# EAGLE design I2CPANEL (EAGLE 9.6.0)
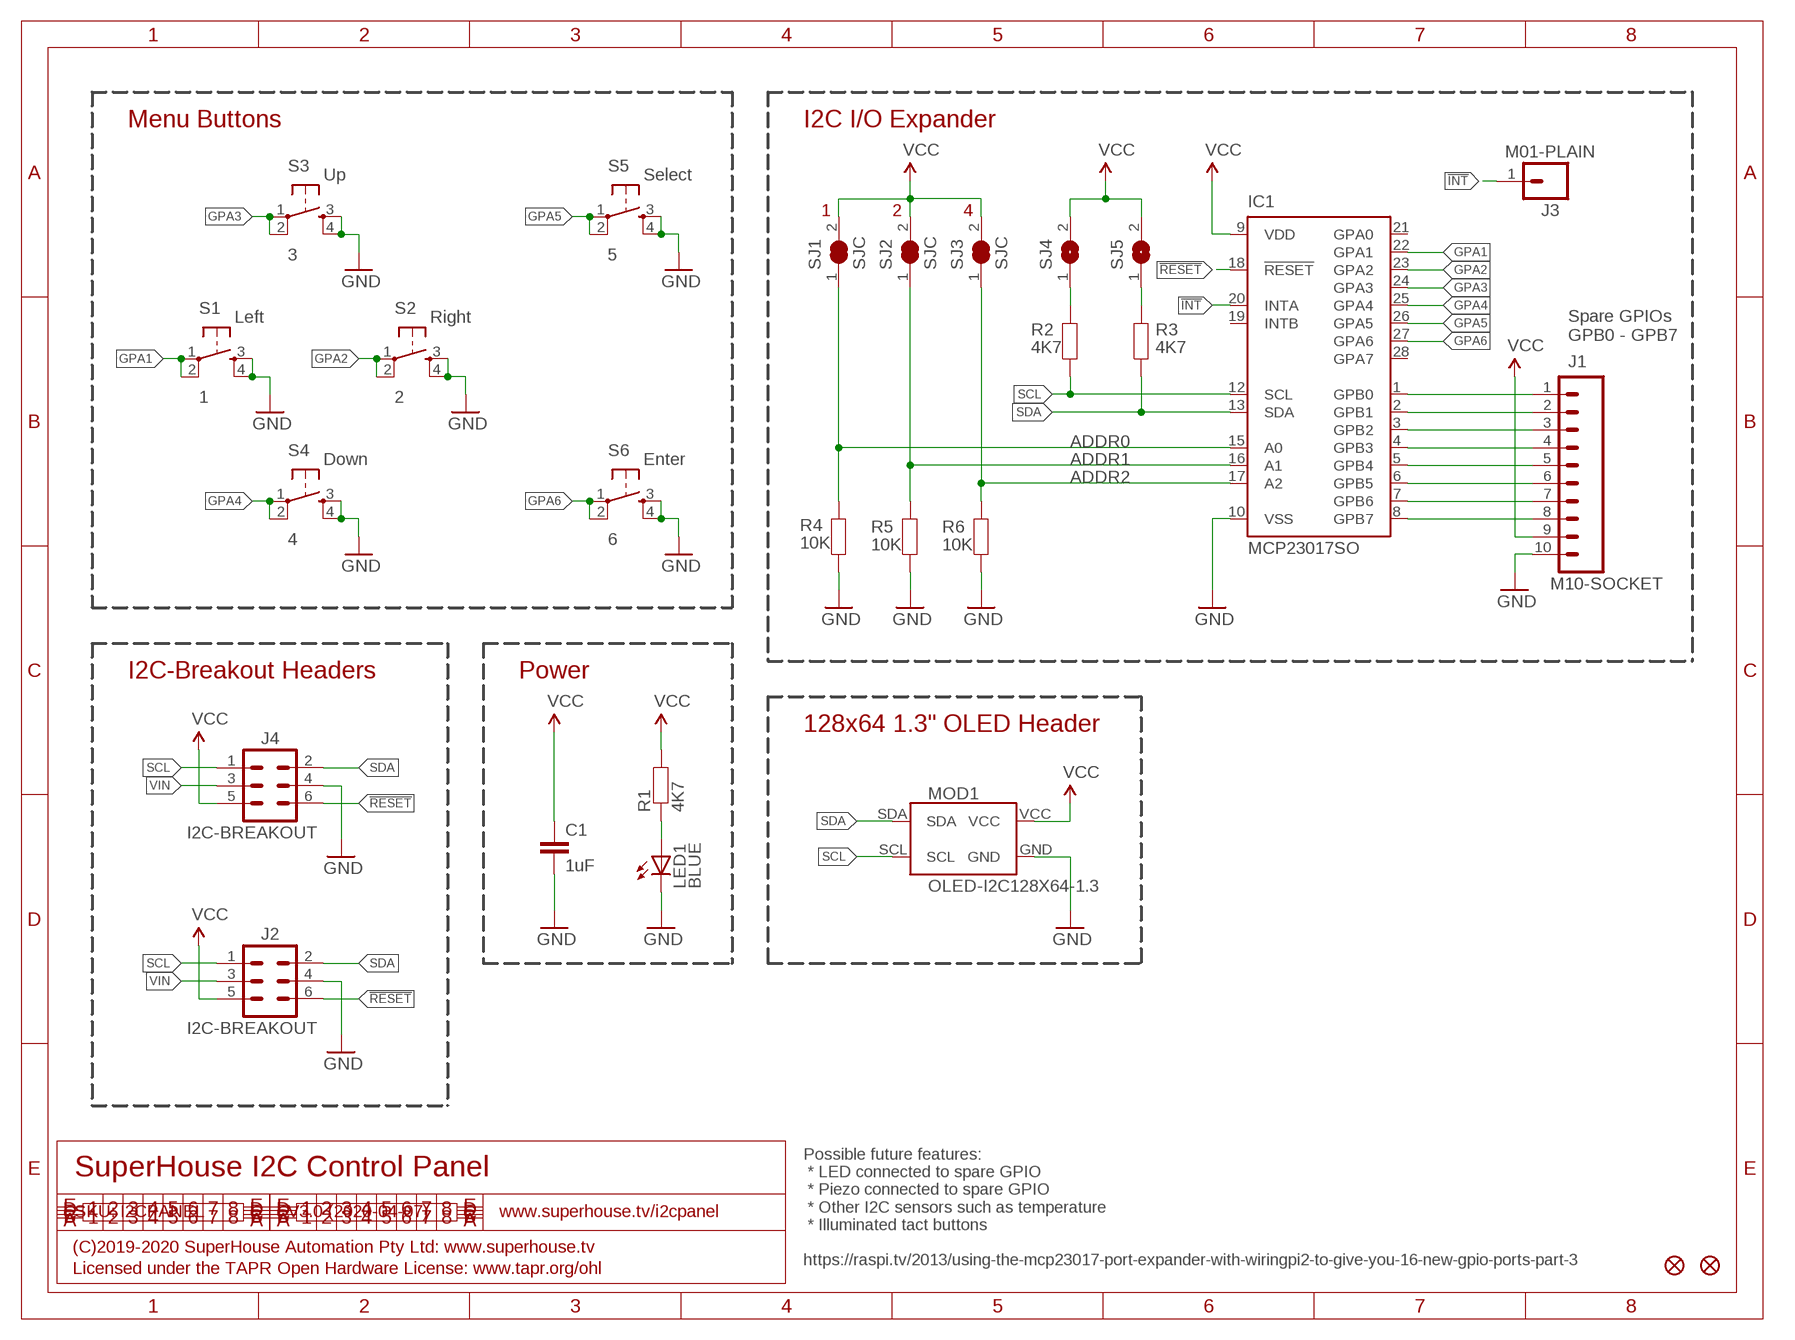
[diagram p0: schematic, sheet 1]

## Parts
C1  1uF  CAP0603  [C0603]
FID1  FIDUCIAL1X2.5  [FIDUCIAL-1X2.5]
FID2  FIDUCIAL1X2.5  [FIDUCIAL-1X2.5]
IC1  MCP23017SO  [SO28W]
J1  M10-SOCKET  [1X10-S]
J2  I2C-BREAKOUT  M02X3-SHROUDED  [2X03-SHROUDED]
J3  M01-PLAIN  [1X01]
J4  I2C-BREAKOUT  M02X3-SHROUDED  [2X03-SHROUDED]
LED1  BLUE  LED0603  [LED-0603]
MOD1  OLED-I2C128X64-1.3  [OLED-128X64-1.3]
R1  4K7  RESISTOR0603  [R0603]
R2  4K7  RESISTOR0603  [R0603]
R3  4K7  RESISTOR0603  [R0603]
R4  10K  RESISTOR0603  [R0603]
R5  10K  RESISTOR0603  [R0603]
R6  10K  RESISTOR0603  [R0603]
S1  1  TAC_SWITCH-PTH-6  [TACTILE-PTH-6MM]
S2  2  TAC_SWITCH-PTH-6  [TACTILE-PTH-6MM]
S3  3  TAC_SWITCH-PTH-6  [TACTILE-PTH-6MM]
S4  4  TAC_SWITCH-PTH-6  [TACTILE-PTH-6MM]
S5  5  TAC_SWITCH-PTH-6  [TACTILE-PTH-6MM]
S6  6  TAC_SWITCH-PTH-6  [TACTILE-PTH-6MM]
SJ1  SJC  SJC-NORMAL  [SJC]
SJ2  SJC  SJC-NORMAL  [SJC]
SJ3  SJC  SJC-NORMAL  [SJC]
SJ4  SJN  [SJ]
SJ5  SJN  [SJ]

## Nets
!INT: IC1.20(INTA) J3.1
!RESET: IC1.18(!RESET) J2.6 J4.6
ADDR0: IC1.15(A0) R4.2 SJ1.1
ADDR1: IC1.16(A1) R5.2 SJ2.1
ADDR2: IC1.17(A2) R6.2 SJ3.1
GND: C1.2 IC1.10(VSS) J1.10 J2.4 J4.4 LED1.C MOD1.GND R4.1 R5.1 R6.1 S1.3 S1.4 S2.3 S2.4 S3.3 S3.4 S4.3 S4.4 S5.3 S5.4 S6.3 S6.4
GPA1: IC1.22(GPA1) S1.1 S1.2
GPA2: IC1.23(GPA2) S2.1 S2.2
GPA3: IC1.24(GPA3) S3.1 S3.2
GPA4: IC1.25(GPA4) S4.1 S4.2
GPA5: IC1.26(GPA5) S5.1 S5.2
GPA6: IC1.27(GPA6) S6.1 S6.2
N$1: IC1.1(GPB0) J1.1
N$2: IC1.2(GPB1) J1.2
N$3: IC1.3(GPB2) J1.3
N$4: IC1.4(GPB3) J1.4
N$5: IC1.5(GPB4) J1.5
N$6: LED1.A R1.1
N$7: IC1.6(GPB5) J1.6
N$8: IC1.7(GPB6) J1.7
N$9: IC1.8(GPB7) J1.8
N$42: R2.2 SJ4.1
N$43: R3.2 SJ5.1
SCL: IC1.12(SCL) J2.1 J4.1 MOD1.SCL R2.1
SDA: IC1.13(SDA) J2.2 J4.2 MOD1.SDA R3.1
VCC: C1.1 IC1.9(VDD) J1.9 J2.5 J4.5 MOD1.VCC R1.2 SJ1.2 SJ2.2 SJ3.2 SJ4.2 SJ5.2
VIN: J2.3 J4.3
Unconnected: IC1.19(INTB) IC1.21(GPA0) IC1.28(GPA7)

## Notes on the sheet
- Menu Buttons | I2C I/O Expander
- Up | Select
- 1 | 2 | 4
- Left | Right
- Spare GPIOs
  GPB0 - GPB7
- Down | Enter
- I2C-Breakout Headers | Power
- 128x64 1.3" OLED Header
- SuperHouse I2C Control Panel
- SKU: I2CPANEL | V3.0 (2020-04-07) | www.superhouse.tv/i2cpanel
- (C)2019-2020 SuperHouse Automation Pty Ltd: www.superhouse.tv
- Possible future features:
   * LED connected to spare GPIO
   * Piezo connected to spare GPIO
   * Other I2C sensors such as temperature
   * Illuminated tact buttons
  
  https://raspi.tv/2013/using-the-mcp23017-port-expander-with-wiringpi2-to-give-you-16-new-gpio-ports-part-3
- Licensed under the TAPR Open Hardware License: www.tapr.org/ohl

## Library data of the parts
C1 = SuperHouse-DiscreteSemi:CAP: Capacitor Standard ceramic capacitor
FID1 FID2 = freetronics:FIDUCIAL: Fiducial Alignment Points Various fiducial points for machine vision alignment.
IC1 = SuperHouse-ICs:MCP23017: http://ww1.microchip.com/downloads/en/DeviceDoc/21952a.pdf Source: http://ww1.microchip.com/downloads/en/DeviceDoc/21952a.pdf
J1 = SuperHouse-Connectors:M10: 1x10 header
J2 J4 = SuperHouse-Connectors:M02X3: 0.1" header, 2x3 (6-way)
J3 = SuperHouse-Connectors:M01: 1-way header Standard 1x1 header
LED1 = SuperHouse-LEDs:LED: LEDs Standard schematic elements and footprints for 5mm, 3mm, 1206, and 0603 sized LEDs. 5mm - Spark Fun Electronics SKU : COM-00529 (and others)
MOD1 = SuperHouse-Displays:OLED-I2C: OLED module with SSD1306 I2C driver
R1-R6 = SuperHouse-DiscreteSemi:RESISTOR: Resistor Standard resistors.
S1-S6 = SuperHouse-Switches:TAC_SWITCH: Momentary Switch Tactile switch, normally-open.
SJ1-SJ3 = SuperHouse-Jumpers:SJC: Solder jumper. Normally closed: does not need solder to close. Can be opened by cutting the track.
SJ4 SJ5 = freetronics-jon:SJ: SMD solder JUMPER

## Net classes
0 default: width 0.152 mm, drill 0.241 mm, clearance 0.152 mm

## Board
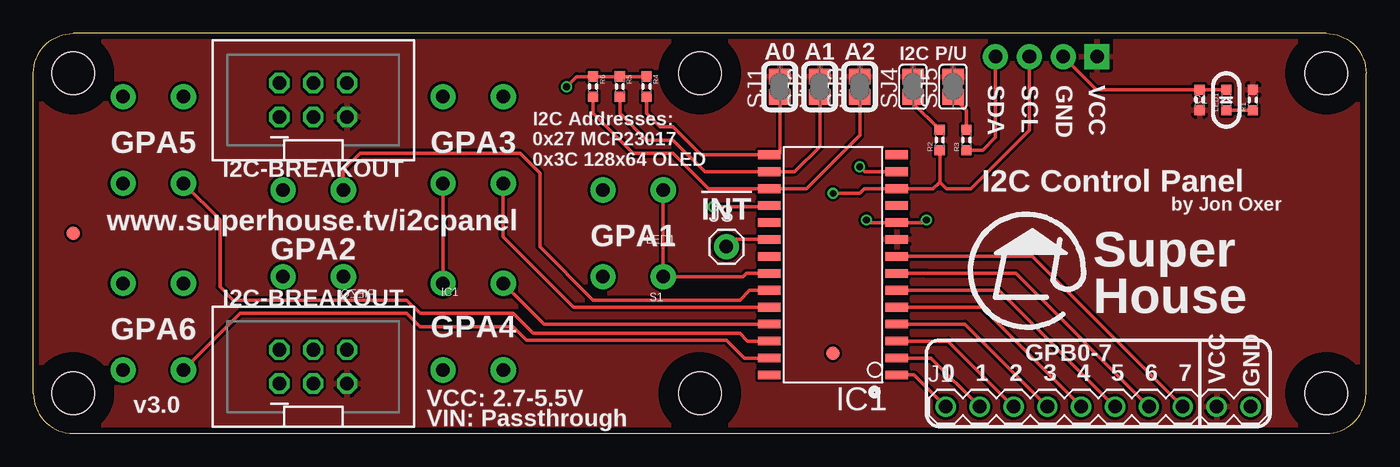
[diagram p1: board, top side]
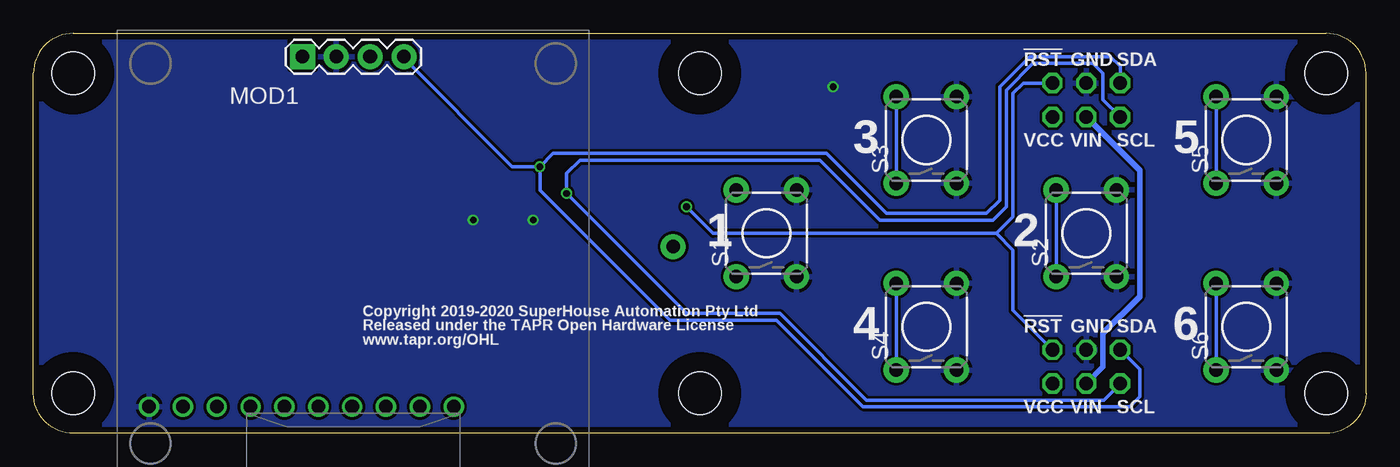
[diagram p2: board, bottom side, seen from below]

Size 100 x 30 mm. Coordinates in mm from the lower left corner, seen from the top.
Outline: 3,0 97,0 arc90 100,3 100,27 arc90 97,30 3,30 arc90 0,27 0,3 arc90 3,0
Copper layers (1*16): Top 0.035mm / dielectric 1.5mm / Bottom 0.035mm
Design rules "freetronics-design-rules": minimum track width 8mil, minimum drill 15mil, track to track 8mil, track to pad 8mil, pad to pad 8mil, via to via 8mil, smd to smd 6mil, copper to edge 18mil, drill to drill 8mil, minimum pad ring 4mil, minimum via ring 6mil, stop-mask expansion 4mil, vias tented up to drill 25mil, thermal gap 10mil
Holes 3.2 mm at 3,27 97,27 3,3 97,3 50,27 50,3
tRestrict: area 0,0 to 6,6; area 47,24 to 53,30; area 47,0 to 53,6; area 94,24 to 100,30; area 94,0 to 100,6; area 0,24 to 6,30
bRestrict: area 0,24 to 6,30; area 0,0 to 6,6; area 47,24 to 53,30; area 47,0 to 53,6; area 94,24 to 100,30; area 94,0 to 100,6

### Footprints (pad centres in the part's own frame; a part is rotated, then mirrored left to right if it is on the bottom)
C0603 = smd 0.762 x 0.762: 1 -0.762,0; 2 0.762,0
FIDUCIAL-1X2.5 = smd 1 x 1: 1 0,0
SO28W = smd 0.65 x 1.7: 1 -7.62,-4.78; 2 -6.35,-4.78; 3 -5.08,-4.78; 4 -3.81,-4.78; 5 -2.54,-4.78; 6 -1.27,-4.78; 7 0,-4.78; 8 1.27,-4.78; 9 2.54,-4.78; 10 3.81,-4.78; 11 5.08,-4.78; 12 6.35,-4.78; 13 7.62,-4.78; 14 8.89,-4.78; 15 8.89,4.78; 16 7.62,4.78; 17 6.35,4.78; 18 5.08,4.78; 19 3.81,4.78; 20 2.54,4.78; 21 1.27,4.78; 22 0,4.78; 23 -1.27,4.78; 24 -2.54,4.78; 25 -3.81,4.78; 26 -5.08,4.78; 27 -6.35,4.78; 28 -7.62,4.78
1X10-S = drill 1.016: 1 0,0; 2 2.54,0; 3 5.08,0; 4 7.62,0; 5 10.16,0; 6 12.7,0; 7 15.24,0; 8 17.78,0; 9 20.32,0; 10 22.86,0
2X03-SHROUDED = drill 1.016 octagon: 1 -1.27,2.54; 2 1.27,2.54; 3 -1.27,0; 4 1.27,0; 5 -1.27,-2.54; 6 1.27,-2.54
1X01 = drill 1.016 pad 1.88: 1 0,0
LED-0603 = smd 0.762 x 0.762: A -0.762,0; C 0.762,0
OLED-128X64-1.3 = drill 1.016 pad 1.88: GND -1.27,14.75; SCL 1.27,14.75; SDA 3.81,14.75 | drill 1.016 pad 1.88 square: VCC -3.81,14.75
R0603 = smd 0.762 x 0.762: 1 -0.762,0; 2 0.762,0
TACTILE-PTH-6MM = drill 1.016 pad 1.88: 1 -3.251,2.261; 2 3.251,2.261; 3 -3.251,-2.261; 4 3.251,-2.261
SJC = smd 1.168 x 1.6: 1 -0.762,0; 2 0.762,0
SJ = smd 1.168 x 1.6: 1 -0.762,0; 2 0.762,0

### Placement (x,y rotation side)
C1  87.5,25 90 top
FID1  60,6 0 top
FID2  3,15 0 top
IC1  60,12 90 top
J1  68.46,2 0 top
J2  21,25 90 top
J3  52,14 0 top
J4  21,5 90 top
LED1  89.5,25 90 top
MOD1  76,13.5 0 bottom
R1  91.5,25 90 top
R2  68,22 90 top
R3  70,22 90 top
R4  46,26 270 top
R5  44,26 270 top
R6  42,26 270 top
S1  45,15 90 bottom
S2  21,15 90 bottom
S3  33,22 90 bottom
S4  33,8 90 bottom
S5  9,22 90 bottom
S6  9,8 90 bottom
SJ1  56,26 90 top
SJ2  59,26 90 top
SJ3  62,26 90 top
SJ4  66,26 90 top
SJ5  69,26 90 top

### Tracks (layer width: path | path; a pad name or v marks a point on that pad's centre or on a via)
!INT
  Top 0.254: IC1.20 52.54,14.54 J3.1
!RESET  (via drill 0.5)
  Top 0.254: v51,17 55.14,17 IC1.18
  Bottom 0.254: 27.75,15 26.5,13.75 26.5,9.23 J4.6 | v51,17 49,15 27.75,15 | 27.75,15 26.5,16.25 26.5,25.5 25.73,26.27 J2.6
ADDR0
  Top 0.254: R4.2 46,24 47,23 48,23 50.11,20.89 IC1.15 55.89,20.89 56,21 SJ1.1
ADDR1
  Top 0.254: SJ2.1 59,21.5 57.12,19.62 IC1.16 50.38,19.62 48,22 46,22 44,24 R5.2
ADDR2
  Top 0.254: SJ3.1 62,22.35 58,18.35 IC1.17 50.65,18.35 48,21 45,21 42,24 R6.2
GND  (via drill 0.5)
  Top 0.254: v62.5,16 62.69,15.81 IC1.10 66.81,15.81 v67,16 | R4.1 R5.1 R6.1 40.76,26.76 v40,26 | LED1.C C1.2 79.76,25.76 MOD1.GND | S3.3 S4.4
  pour Bottom: 0,27 arc-90 3,30 97,30 arc-90 100,27 100,3 arc-74 97,0 3,0 arc-74 0,3
GPA1
  Top 0.254: S1.2 S1.1 53.25,11.75 53.5,12 IC1.22
GPA2
  Top 0.254: S2.2 23.26,19.76 24.5,21 36.5,21 38,19.5 38,14 42,10 53,10 53.73,10.73 IC1.23
  Bottom 0.254: S2.1 S2.2
GPA3
  Top 0.254: IC1.24 40.54,9.46 35.26,14.74 S3.1
  Bottom 0.254: S3.2 S3.1
GPA4
  Top 0.254: IC1.25 38.32,8.19 S4.2
  Bottom 0.254: S4.1 S4.2
GPA5
  Top 0.254: IC1.26 53.58,6.92 53,7.5 37.5,7.5 36,9 29,9 28,10 15,10 14,11 14,16.01 S5.1
  Bottom 0.254: S5.2 S5.1
GPA6
  Top 0.254: IC1.27 53.35,5.65 52,7 37,7 36,8 29,8 28,9 15.51,9 13.01,6.5 12.76,6.24 S6.1
  Bottom 0.254: S6.1 S6.2
N$1
  Top 0.254: IC1.1 66.08,4.38 J1.1
N$2
  Top 0.254: J1.2 67.35,5.65 IC1.2
N$3
  Top 0.254: J1.3 68.62,6.92 IC1.3
N$4
  Top 0.254: J1.4 69.89,8.19 IC1.4
N$5
  Top 0.254: J1.5 71.16,9.46 IC1.5
N$6
  Top 0.254: LED1.A R1.1
N$7
  Top 0.254: J1.6 72.43,10.73 IC1.6
N$8
  Top 0.254: IC1.7 67,12 67.15,12 73.7,12 J1.7
N$9
  Top 0.254: J1.8 74.97,13.27 IC1.8
N$42
  Top 0.254: R2.2 66,24.76 SJ4.1
N$43
  Top 0.254: R3.2 70,24.24 SJ5.1
SCL  (via drill 0.5)
  Top 0.254: v60,18 62,18 62.35,18.35 IC1.12 67.5,18.35 68,18.85 | MOD1.SCL 74.73,22.73 70.35,18.35 68.5,18.35 68,18.85 | R2.1 68,18.85
  Bottom 0.254: J4.1 19.69,2.5 37.5,2.5 44,9 51,9 v60,18 60,19.5 59,20.5 41,20.5 36.5,16 28,16 27,17 27,25.75 25,27.75 20.5,27.75 19.75,27 19.75,25.02 J2.1
SDA  (via drill 0.5)
  Top 0.254: IC1.13 62.38,19.62 v62,20 | MOD1.SDA 72.19,22.19 71.24,21.24 R3.1
  Bottom 0.254: v62,20 62,18.25 52.25,8.5 44.25,8.5 37.75,2 17.75,2 17,2.75 17,4.81 J4.2 | v62,20 64.07,20 72.19,28.12 MOD1.SDA | v62,20 61,21 40.5,21 36,16.5 28.5,16.5 27.5,17.5 27.5,26 25.25,28.25 19.19,28.25 18.46,27.52 J2.2
VCC
  pour Top: 0,27 arc-90 3,30 97,30 arc-90 100,27 100,3 arc-74 97,0 3,0 arc-74 0,3
VIN
  Bottom 0.406: J2.3 17,19.73 17,10.25 19.75,7.5 19.75,4.98 J4.3

### Text on the board
tPlace: A0 | A1 | A2 | I2C P/U | SDA | SCL | GND | VCC | GPA5 | GPA3 | I2C Addresses: / 0x27 MCP23017 / 0x3C 128x64 OLED | I2C-BREAKOUT | I2C Control Panel | by Jon Oxer | !INT | www.superhouse.tv/i2cpanel | GPA1 | GPA2 | I2C-BREAKOUT | Super / House | GPA6 | GPA4 | GPB0-7 | 0 | 1 | 2 | 3 | 4 | 5 | 6 | 7 | VCC | GND | v3.0 | VCC: 2.7-5.5V | VIN: Passthrough
bPlace: SDA | GND | !RST | SCL | VIN | VCC | 5 | 3 | 2 | 1 | SDA | GND | !RST | 6 | 4 | Copyright 2019-2020 SuperHouse Automation Pty Ltd / Released under the TAPR Open Hardware License / www.tapr.org/OHL | SCL | VIN | VCC
tNames: LED1 | PIEZO | IC1 | S1